# EAGLE design joey (EAGLE 6.2)
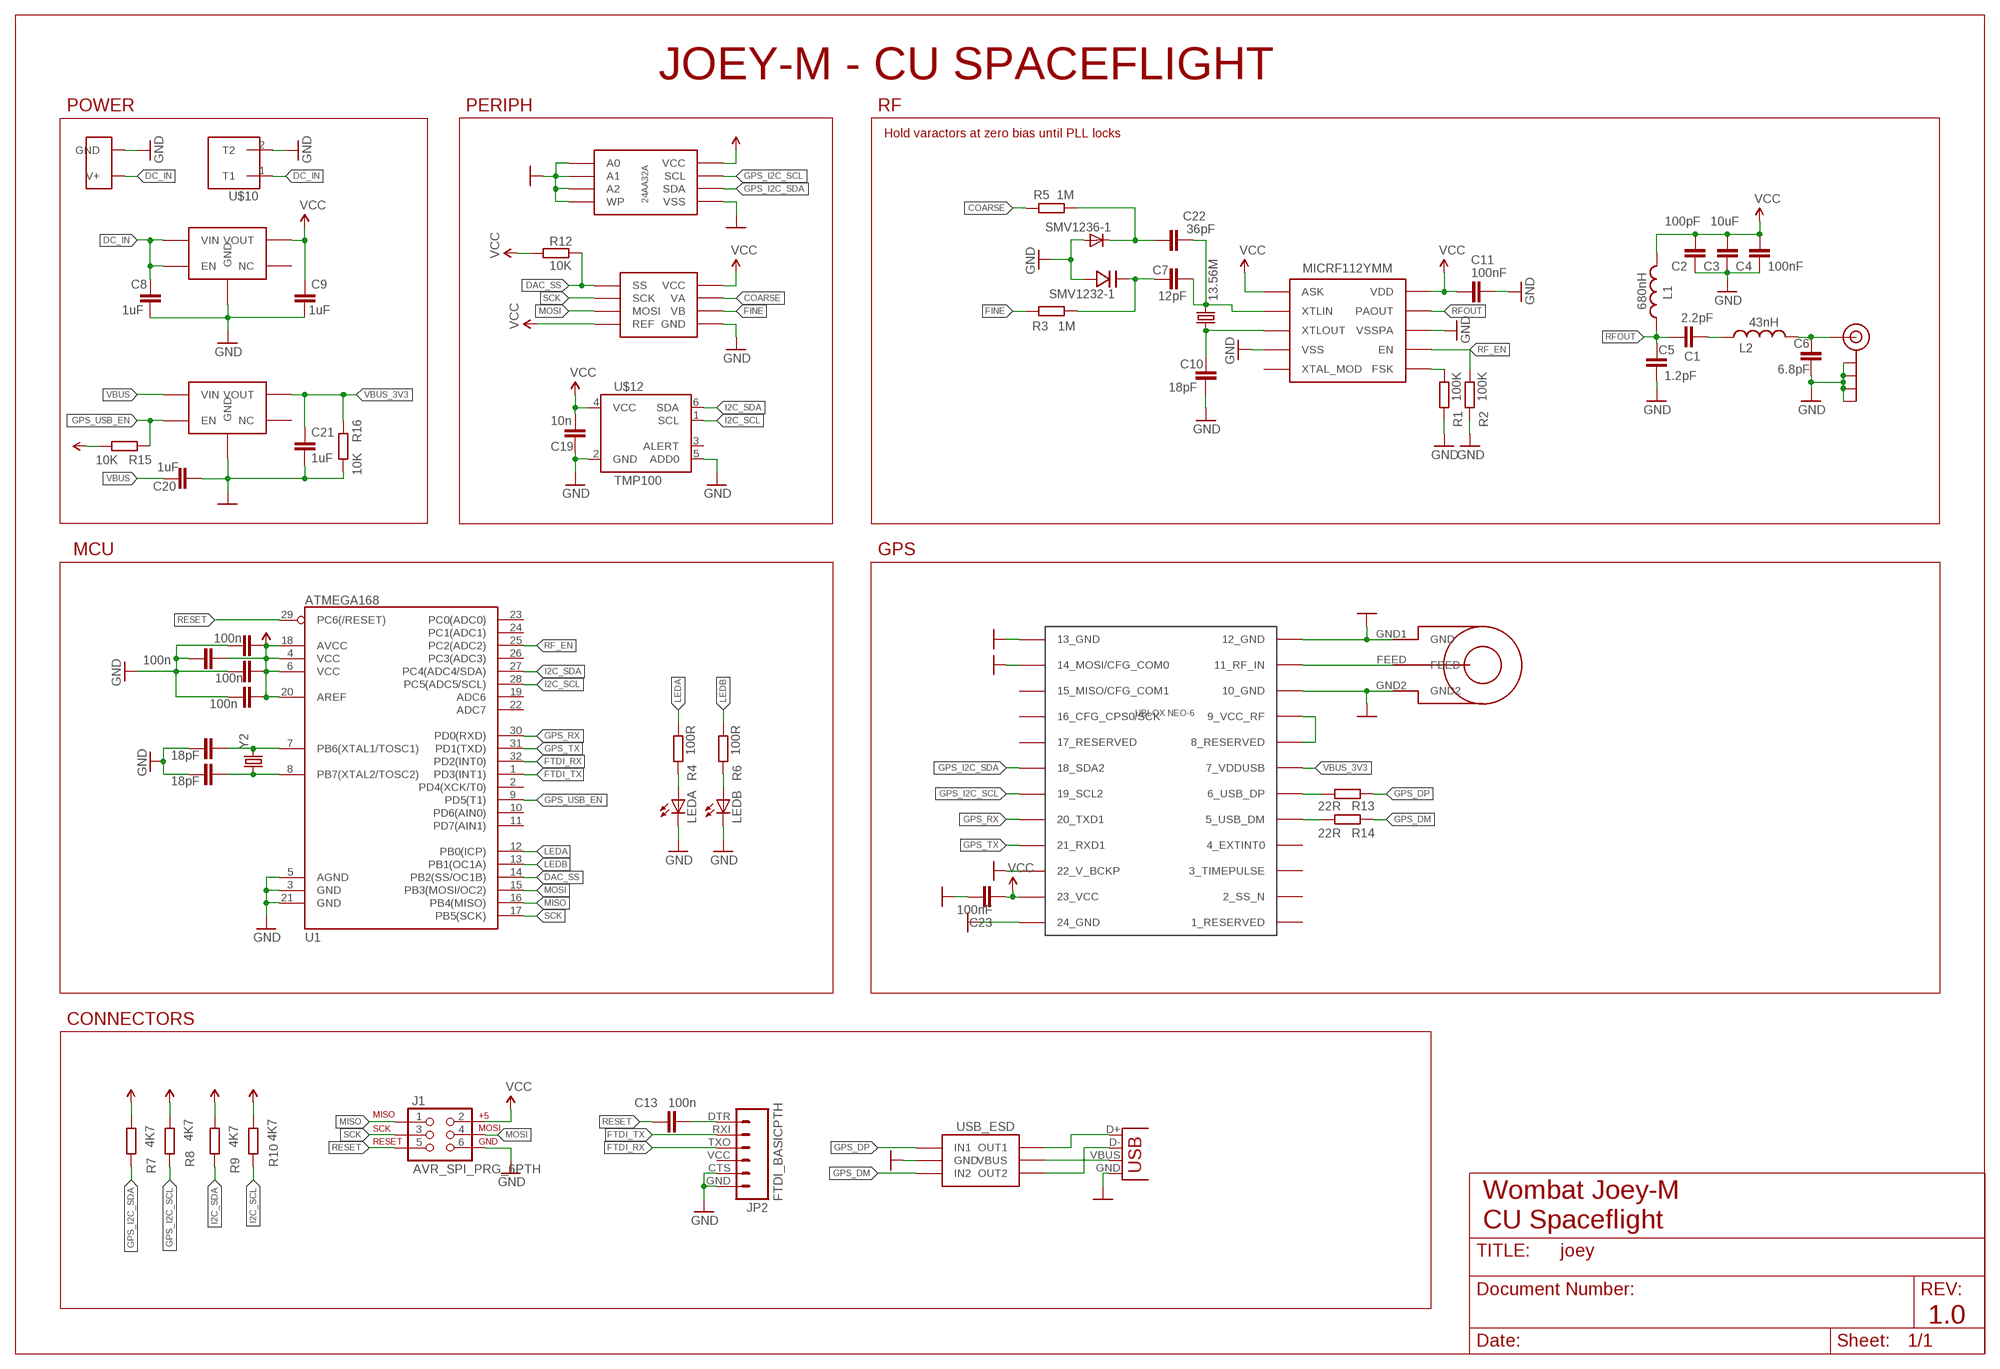
[diagram p0: schematic, sheet 1]

## Parts
C1  2.2pF  C-EUC0603  [C0603]
C2  100pF  C-EUC0603  [C0603]
C3  10uF  C-EUC0603  [C0603]
C4  100nF  C-EUC0603  [C0603]
C5  1.2pF  C-EUC0603  [C0603]
C6  6.8pF  C-EUC0603  [C0603]
C7  12pF  C-EUC0603  [C0603]
C8  1uF  C-EUC0603  [C0603]
C9  1uF  C-EUC0603  [C0603]
C10  18pF  C-EUC0603  [C0603]
C11  100nF  C-EUC0603  [C0603]
C12  100n  C-EUC0603  [C0603]
C13  100n  C-EUC0603  [C0603]
C14  100n  C-EUC0603  [C0603]
C15  100n  C-EUC0603  [C0603]
C16  100n  C-EUC0603  [C0603]
C17  18pF  C-EUC0603  [C0603]
C18  18pF  C-EUC0603  [C0603]
C19  10n  C-EUC0603  [C0603]
C20  1uF  C-EUC0603  [C0603]
C21  1uF  C-EUC0603  [C0603]
C22  36pF  C-EUC0603  [C0603]
C23  100nF  C-EUC0603  [C0603]
J1  AVR_SPI_PRG_6PTH  [2X3]
JP2  FTDI_BASICPTH  [FTDI_BASIC]
L1  680nH  INDUCTOR0603  [0603]
L2  43nH  INDUCTOR0402  [C0402]
LEDA  LED0603  [LED-0603]
LEDB  LED0603  [LED-0603]
R1  100K  R-EU_R0603  [R0603]
R2  100K  R-EU_R0603  [R0603]
R3  1M  R-EU_R0603  [R0603]
R4  100R  R-EU_R0603  [R0603]
R5  1M  R-EU_R0603  [R0603]
R6  100R  R-EU_R0603  [R0603]
R7  4K7  R-EU_R0603  [R0603]
R8  4K7  R-EU_R0603  [R0603]
R9  4K7  R-EU_R0603  [R0603]
R10  4K7  R-EU_R0603  [R0603]
R12  10K  R-EU_R0603  [R0603]
R13  22R  R-EU_R0603  [R0603]
R14  22R  R-EU_R0603  [R0603]
R15  10K  R-EU_R0603  [R0603]
R16  10K  R-EU_R0603  [R0603]
SMV1232-1  SMV1247-VARACTOR  [SMV1247-VARACTOR-SC-79]
SMV1236-1  DIODESOD  [SOD-323]
U1  ATMEGA168  [TQFP32-08]
U$1  MICRF112  [MICRF112-MSOP10]
U$2  SARANTEL-SR1202  [SARANTEL-SR1202]
U$3  UBLOX_NEO-6  [UBLOX_NEO-6P]
U$4  ADP122AUJZ-3V3REG-5TSOT  [SOT23-5L]
U$5  JST_SMTSIDE  [JST_CONN_SMD]
U$6  I2C_EEPROM_24AA32A  [MSOP8]
U$7  SMA_END_19-70-TGG  [SMA_END_19-70-TGG]
U$8  LTC2602_16BIT_DUALDAC  [MSOP8]
U$9  ADP122AUJZ-3V3REG-5TSOT  [SOT23-5L]
U$10  TE_CONN_TERMBLK  [10A_TECONN_TERMBLK]
U$12  TMP100  [SOT23-6]
USB_ESD  USB_ESD_PROT_USBLC6  [SOT23-6]
X1  USB-MICROB  [USB-MICROB]
Y1  13.56M  CRYSTAL5X3  [CRYSTAL-SMD-5X3]
Y2  CRYSTAL5X3  [CRYSTAL-SMD-5X3]

## Nets
COARSE: R5.1 U$8.8(VA)
COARSE_V: C22.1 R5.2 SMV1236-1.1(C)
DAC_SS: R12.2 U1.14(PB2(SS/OC1B)) U$8.1(SS)
DC_IN: C8.2 U$4.1(VIN) U$4.3(EN) U$5.VBATT(V+) U$10.1(T1)
FINE: R3.2 U$8.5(VB)
FTDI_RX: JP2.TXO U1.32(PD2(INT0))
FTDI_TX: JP2.RXI U1.1(PD3(INT1))
GND: C2.1 C3.1 C4.1 C5.1 C6.1 C8.1 C9.1 C10.1 C11.1 C12.2 C14.1 C15.1 C16.1 C17.2 C18.2 C19.1 C20.1 C21.1 C23.1 J1.6 JP2.CTS JP2.GND LEDA.C LEDB.C R1.1 R2.1 R16.2 SMV1232-1.AN(ANODE) SMV1236-1.2(A) U1.3(GND) U1.5(AGND) U1.21(GND) U$1.VSS U$1.VSSPA U$2.GND1(GND) U$2.GND2 U$3.10_GND U$3.12_GND U$3.13_GND U$3.14_MOSI/CFG_COM0 U$3.22_V_BCKP U$3.24_GND U$4.2(GND) U$5.GND U$6.1(A0) U$6.2(A1) U$6.3(A2) U$6.4(VSS) U$6.7(WP) U$7.GND1(GND) U$7.GND2(GND) U$7.GND3(GND) U$7.GND4(GND) U$8.7(GND) U$9.2(GND) U$10.2(T2) U$12.2(GND) U$12.5(ADD0) USB_ESD.2(GND) X1.GND
GPS_DM: R14.1 USB_ESD.3(IN2)
GPS_DP: R13.1 USB_ESD.1(IN1)
GPS_I2C_SCL: R8.1 U$3.19_SCL2 U$6.6(SCL)
GPS_I2C_SDA: R7.1 U$3.18_SDA2 U$6.5(SDA)
GPS_RX: U1.30(PD0(RXD)) U$3.20_TXD1
GPS_TX: U1.31(PD1(TXD)) U$3.21_RXD1
GPS_USB_EN: R15.1 U1.9(PD5(T1)) U$9.3(EN)
I2C_SCL: R10.1 U1.28(PC5(ADC5/SCL)) U$12.1(SCL)
I2C_SDA: R9.1 U1.27(PC4(ADC4/SDA)) U$12.6(SDA)
LEDA: R4.2 U1.12(PB0(ICP))
LEDB: R6.2 U1.13(PB1(OC1A))
MISO: J1.1 U1.16(PB4(MISO))
MOSI: J1.4 U1.15(PB3(MOSI/OC2)) U$8.3(MOSI)
N$1: R1.2 U$1.FSK
N$2: C10.2 U$1.XTLOUT Y1.1
N$3: C13.2 JP2.DTR
N$5: C7.2 C22.2 U$1.XTLIN Y1.3
N$6: C1.2 L2.1
N$7: C6.2 L2.2 U$7.RF(SIGNAL)
N$8: C7.1 R3.1 SMV1232-1.CAT(CATHODE)
N$9: LEDA.A R4.1
N$11: C17.1 U1.7(PB6(XTAL1/TOSC1)) Y2.3
N$12: C18.1 U1.8(PB7(XTAL2/TOSC2)) Y2.1
N$13: U$2.FEED U$3.11_RF_IN
N$14: LEDB.A R6.1
N$15: U$3.8_RESERVED U$3.9_VCC_RF
N$18: USB_ESD.4(OUT2) X1.D-
N$19: USB_ESD.6(OUT1) X1.D+
N$20: R13.2 U$3.6_USB_DP
N$21: R14.2 U$3.5_USB_DM
RESET: C13.1 J1.5 U1.29(PC6(/RESET))
RF_EN: R2.2 U1.25(PC2(ADC2)) U$1.EN
RFOUT: C1.1 C5.2 L1.1 U$1.PAOUT
SCK: J1.3 U1.17(PB5(SCK)) U$8.2(SCK)
VBUS: C20.2 U$9.1(VIN) USB_ESD.5(VBUS) X1.VBUS
VBUS_3V3: C21.2 R16.1 U$3.7_VDDUSB U$9.5(VOUT)
VCC: C2.2 C3.2 C4.2 C9.2 C11.2 C12.1 C14.2 C15.2 C16.2 C19.2 C23.2 J1.2 L1.2 R7.2 R8.2 R9.2 R10.2 R12.1 R15.2 U1.4(VCC) U1.6(VCC) U1.18(AVCC) U1.20(AREF) U$1.ASK U$1.VDD U$3.23_VCC U$4.5(VOUT) U$6.8(VCC) U$8.4(REF) U$8.6(VCC) U$12.4(VCC)
Unconnected: JP2.VCC U1.2(PD4(XCK/T0)) U1.10(PD6(AIN0)) U1.11(PD7(AIN1)) U1.19(ADC6) U1.22(ADC7) U1.23(PC0(ADC0)) U1.24(PC1(ADC1)) U1.26(PC3(ADC3)) U$1.XTAL_MOD U$3.1_RESERVED U$3.2_SS_N U$3.3_TIMEPULSE U$3.4_EXTINT0 U$3.15_MISO/CFG_COM1 U$3.16_CFG_CPS0/SCK U$3.17_RESERVED U$4.4(NC) U$9.4(NC) U$12.3(ALERT)

## Notes on the sheet
- JOEY-M - CU SPACEFLIGHT
- POWER | PERIPH | RF
- Hold varactors at zero bias until PLL locks
- MCU | GPS
- CONNECTORS
- Wombat Joey-M
- CU Spaceflight
- 1.0

## Library data of the parts
C1-C23 = rcl:C-EU: CAPACITOR, European symbol
J1 = SparkFun:AVR_SPI_PRG_6: AVR ISP 6 Pin This is the reduced ISP connector for AVR programming. Common on Arduino. This footprint will take up less PCB space and can be used with a 10-pin to 6-pin adapter such as SKU: BOB-08508
JP2 = SparkFun:FTDI_BASIC: FTDI Basic: 3.3V and 5V
L1 L2 = SparkFun:INDUCTOR: Inductors Basic Inductor/Choke - 0603 and 1206. Footprints are not proven and vary greatly between part numbers.
LEDA LEDB = SparkFun:LED: LEDs Standard schematic elements and footprints for 5mm, 3mm, 1206, and 0603 sized LEDs. 5mm - Spark Fun Electronics SKU : COM-00529 (and others)
R1-R10 R12-R16 = rcl:R-EU_: RESISTOR, European symbol
SMV1232-1 = jonsowman:SMV1247-VARACTOR
SMV1236-1 = SparkFun:DIODE: Diode These are standard reverse protection diodes and small signal diodes. SMA package can handle up to about 1A. SOD-323 can handle about 200mA. What the SOD-323 package when ordering, there are some mfgs out there that are 5-pin packages.
U1 = SparkFun:ATMEGA168
U$1 = jonsowman:MICRF112
U$2 = ava:SARANTEL-SR1202: SARANTEL-SL1202 Author Anthony Stirk / http://ava.upuaut.net Data Sheet : http://docs-europe.electrocomponents.com/webdocs/0dbd/0900766b80dbde80.pdf
U$3 = ava:UBLOX_NEO-6: UBLOX NEO-6 GPS MODULE Author Anthony Stirk / http://ava.upuaut.net http://www.u-blox.com/images/downloads/Product_Docs/LEA-6_NEO-6_MAX-6_HardwareIntegrationManual_%28GPS.G6-HW-09007%29.pdf http://www.u-blox.com/images/downloads/Product_Docs/NEO-6_DataSheet_%28GPS.G6-HW-09005%29.pdf
U$4 U$9 = jonsowman:ADP122AUJZ-3V3REG-5TSOT
U$5 = jonsowman:JST_SMTSIDE
U$6 = jonsowman:I2C_EEPROM_24AA32A
U$7 = jonsowman:SMA_END_19-70-TGG
U$8 = jonsowman:LTC2602_16BIT_DUALDAC
U$10 = jonsowman:TE_CONN_TERMBLK
U$12 = jonsowman:TMP100
USB_ESD = jonsowman:USB_ESD_PROT_USBLC6
X1 = SparkFun:USB: USB Connectors USB-B-PTH is fully proven SKU : PRT-00139 USB-miniB is fully proven SKU : PRT-00587 USB-A-PCB is untested. USB-A-H is throughly reviewed, but untested. Spark Fun Electronics SKU : PRT-00437 USB-B-SMT is throughly reviewed, but untested. Needs silkscreen touching up. USB-A-S has not been used/tested USB-MB-H has not been used/tested
Y1 Y2 = SparkFun:CRYSTAL: Crystals Various standard crystals. Proven footprints. Spark Fun Electronics SKU : COM-00534

## Board
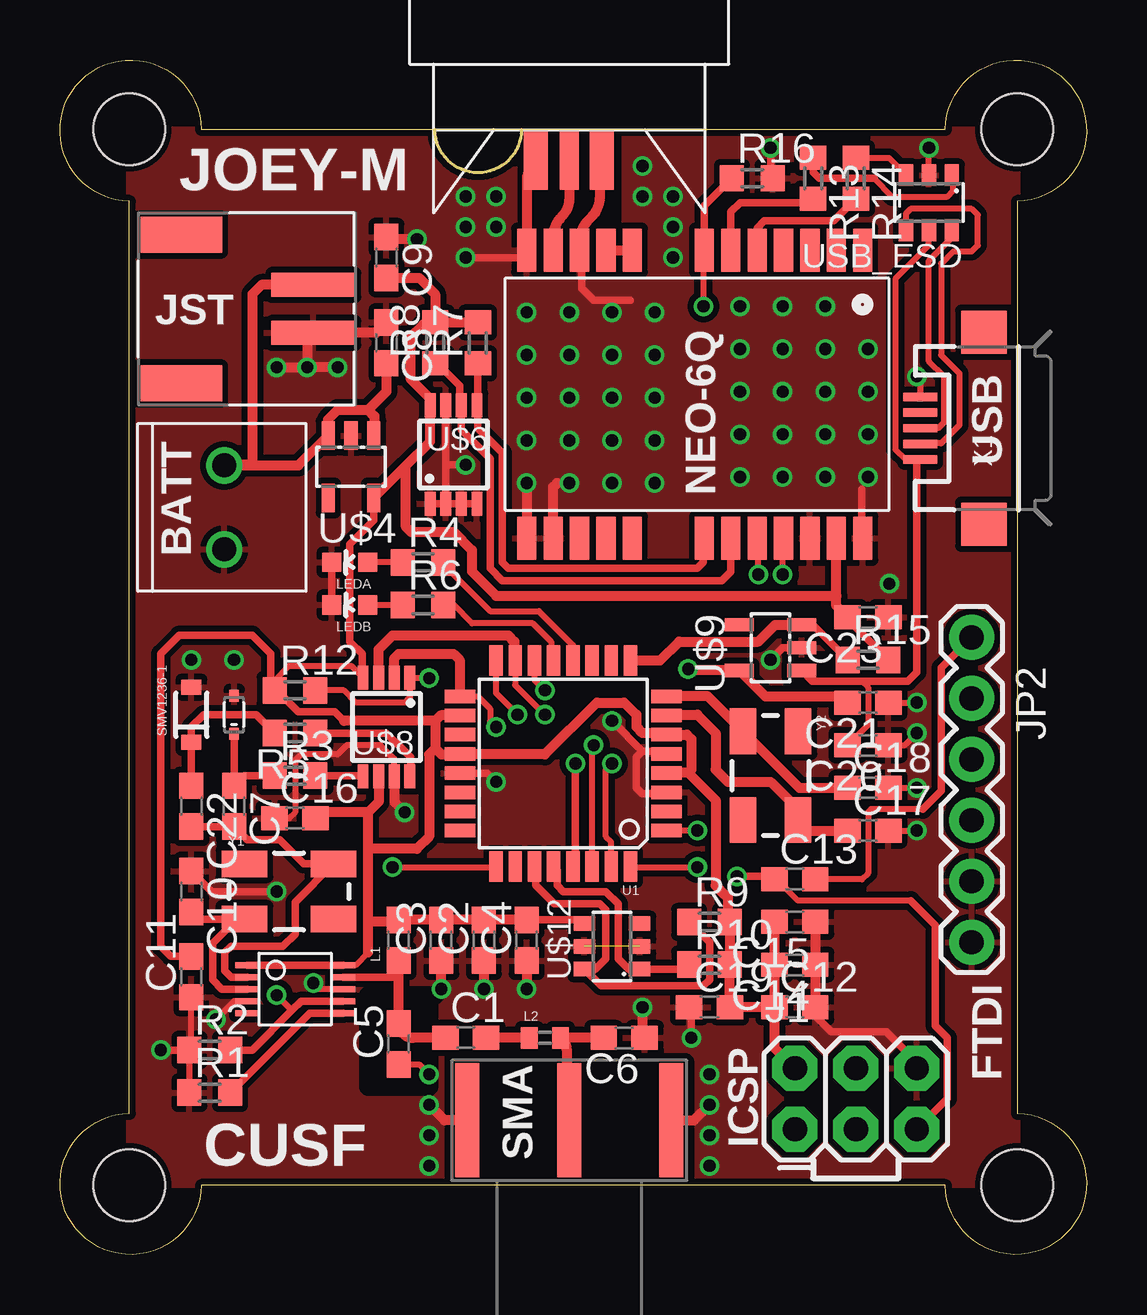
[diagram p1: board, top side]
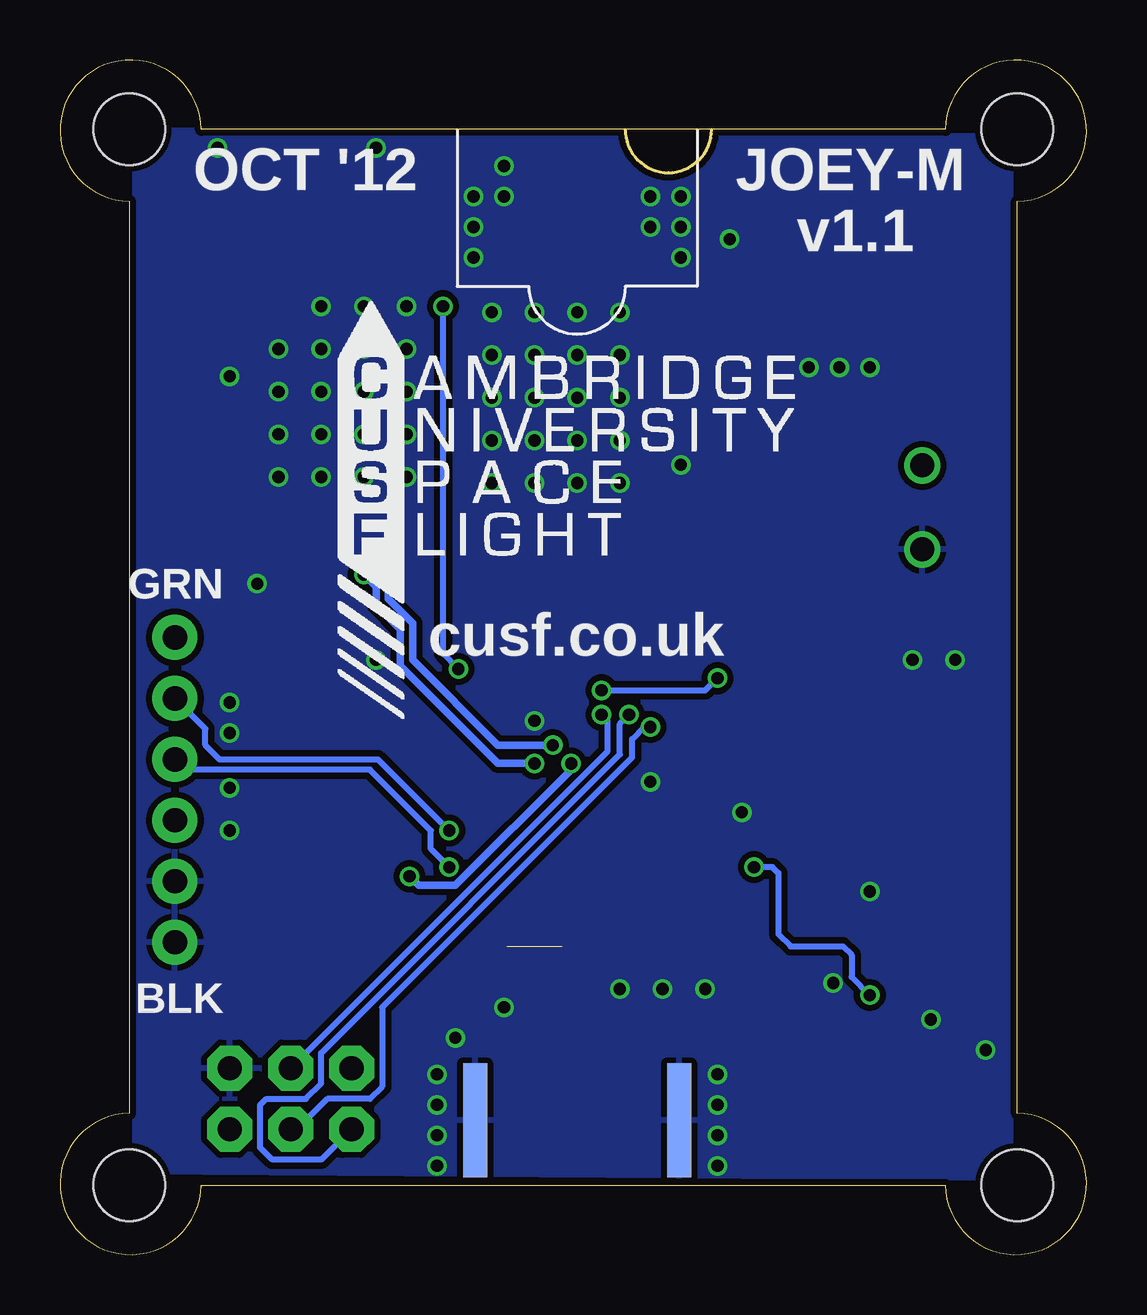
[diagram p2: board, bottom side, seen from below]

Size 42.77 x 49.77 mm. Coordinates in mm from the lower left corner, seen from the top.
Outline: 36.89,46.89 arc-268 39.89,43.89 39.89,5.89 arc-268 36.89,2.89 5.89,2.89 arc-268 2.89,5.89 2.89,43.89 arc-268 5.89,46.89 36.89,46.89
Copper layers (1*16): Top 0.035mm / dielectric 1.5mm / Bottom 0.035mm
Design rules: minimum track width 10mil, minimum drill 12mil, track to track 6mil, track to pad 6mil, pad to pad 6mil, via to via 6mil, smd to smd 0mil, copper to edge 10mil, drill to drill 10mil, minimum pad ring 10mil, minimum via ring 6mil, stop-mask expansion 2mil, vias tented up to drill 100mil, thermal gap 10mil
Holes 3 mm at 39.89,46.89 39.89,2.89 2.89,2.89 2.89,46.89
tRestrict: area 12.8,7 to 15.6,10.8; area 19.4,42.1 to 23,46.6; area 16.4,3.2 to 26,8

### Footprints (pad centres in the part's own frame; a part is rotated, then mirrored left to right if it is on the bottom)
C0603 = smd 1.1 x 1: 1 -0.85,0; 2 0.85,0
2X3 = drill 1.016 pad 1.88 octagon: 1 0,0; 2 0,2.54; 3 2.54,0; 4 2.54,2.54; 5 5.08,0; 6 5.08,2.54
FTDI_BASIC = drill 1.016 pad 1.88: CTS 10.16,0; DTR 0,0; GND 12.7,0; RXI 2.54,0; TXO 5.08,0; VCC 7.62,0
0603 = smd 1.1 x 1: 1 -0.85,0; 2 0.85,0
C0402 = smd 0.7 x 0.9: 1 -0.65,0; 2 0.65,0
LED-0603 = smd 0.8 x 0.8: A 0,-0.75; C 0,0.75
R0603 = smd 1 x 1.1: 1 -0.85,0; 2 0.85,0
SMV1247-VARACTOR-SC-79 = smd 0.5 x 0.4: AN 0.8,0; CAT -0.8,0
SOD-323 = smd 0.63 x 0.83: 1 -1.15,0; 2 1.15,0
TQFP32-08 = smd 1.27 x 0.559: 1 -4.293,2.8; 2 -4.293,2; 3 -4.293,1.2; 4 -4.293,0.4; 5 -4.293,-0.4; 6 -4.293,-1.2; 7 -4.293,-2; 8 -4.293,-2.8; 17 4.293,-2.8; 18 4.293,-2; 19 4.293,-1.2; 20 4.293,-0.4; 21 4.293,0.4; 22 4.293,1.2; 23 4.293,2; 24 4.293,2.8 | smd 0.559 x 1.27: 9 -2.8,-4.293; 10 -2,-4.293; 11 -1.2,-4.293; 12 -0.4,-4.293; 13 0.4,-4.293; 14 1.2,-4.293; 15 2,-4.293; 16 2.8,-4.293; 25 2.8,4.293; 26 2,4.293; 27 1.2,4.293; 28 0.4,4.293; 29 -0.4,4.293; 30 -1.2,4.293; 31 -2,4.293; 32 -2.8,4.293
MICRF112-MSOP10 = smd 0.25 x 1: ASK -1,-2; EN 0.5,2; FSK 1,2; PAOUT -0.5,2; VDD -1,2; VSS 0.5,-2; VSSPA 0,2; XTAL_MOD 1,-2; XTLIN -0.5,-2; XTLOUT 0,-2
SARANTEL-SR1202 = smd 2.5 x 0.8: FEED 0,0 | smd 2.5 x 1: GND1 0,1.4; GND2 0,-1.35
UBLOX_NEO-6P = smd 1.8 x 0.8: 1_RESERVED 6.4,-7.4; 2_SS_N 6.4,-6.3; 3_TIMEPULSE 6.4,-5.2; 4_EXTINT0 6.4,-4.1; 5_USB_DM 6.4,-3; 6_USB_DP 6.4,-1.9; 7_VDDUSB 6.4,-0.8; 8_RESERVED 6.4,2.2; 9_VCC_RF 6.4,3.3; 10_GND 6.4,4.4; 11_RF_IN 6.4,5.5; 12_GND 6.4,6.6; 13_GND -5.6,6.6; 14_MOSI/CFG_COM0 -5.6,5.5; 15_MISO/CFG_COM1 -5.6,4.4; 16_CFG_CPS0/SCK -5.6,3.3; 17_RESERVED -5.6,2.2; 18_SDA2 -5.6,-0.8; 19_SCL2 -5.6,-1.9; 20_TXD1 -5.6,-3; 21_RXD1 -5.6,-4.1; 22_V_BCKP -5.6,-5.2; 23_VCC -5.6,-6.3; 24_GND -5.6,-7.4
SOT23-5L = smd 0.55 x 1.2: 1 -0.95,-1.3; 2 0,-1.3; 3 0.95,-1.3; 4 0.95,1.3; 5 -0.95,1.3
JST_CONN_SMD = smd 1 x 3.5: GND -1,-2.8; VBATT 1,-2.8 | smd 1.5 x 3.4: NC1 -3.1,2.7; NC2 3.1,2.7
MSOP8 = smd 0.45 x 1: 1 -0.975,-2.05; 2 -0.325,-2.05; 3 0.325,-2.05; 4 0.975,-2.05; 5 0.975,2.05; 6 0.325,2.05; 7 -0.325,2.05; 8 -0.975,2.05
SMA_END_19-70-TGG = smd 1 x 4.75: GND1 -4.25,-2.4; GND2 4.25,-2.4; RF 0,-2.4 | smd 1 x 4.75 bottom: GND3 -4.25,-2.4; GND4 4.25,-2.4
10A_TECONN_TERMBLK = drill 1: 1 -1.75,0.1; 2 1.75,0.1
SOT23-6 = smd 0.6 x 0.9: 1 -0.95,-1.15; 2 0,-1.15; 3 0.95,-1.15; 4 0.95,1.15; 5 0,1.15; 6 -0.95,1.15
USB-MICROB = smd 0.35 x 1.4: D+ 0,2.65; D- -0.65,2.65; GND 1.3,2.65; ID 0.65,2.65; VBUS -1.3,2.65 | smd 1.8 x 1.9: MT1 -4,0; MT2 4,0
CRYSTAL-SMD-5X3 = smd 1.9 x 1.1: 1 -1.85,-1.15; 2 1.85,-1.15; 3 1.85,1.15; 4 -1.85,1.15

### Placement (x,y rotation side)
C1  16.9,9.03 0 top
C2  17.67,13.09 90 top
C3  15.89,13.09 90 top
C4  19.44,13.09 90 top
C5  14.11,8.78 90 top
C6  23.51,9.03 180 top
C7  7.25,18.68 270 top
C8  13.6,37.99 270 top
C9  13.6,41.54 270 top
C10  5.47,15.13 270 top
C11  5.47,11.57 90 top
C12  30.62,10.3 0 top
C13  30.62,15.63 0 top
C14  30.62,12.08 180 top
C15  30.62,13.86 180 top
C16  9.79,18.17 0 top
C17  33.67,17.67 0 top
C18  33.67,19.44 0 top
C19  27.06,10.3 0 top
C20  33.67,21.22 180 top
C21  33.67,23 180 top
C22  5.47,18.68 270 top
C23  33.67,26.56 180 top
J1  30.62,5.22 0 top
JP2  37.99,25.71 270 top
L1  14.11,13.09 90 top
L2  20.21,9.03 0 top
LEDA  12.08,28.84 90 top
LEDB  12.08,27.06 90 top
R1  6.24,6.74 0 top
R2  6.24,8.52 0 top
R3  9.79,19.95 0 top
R4  15.13,28.84 0 top
R5  9.79,21.73 180 top
R6  15.13,27.06 0 top
R7  17.41,37.99 90 top
R8  15.63,37.99 90 top
R9  27.06,13.86 0 top
R10  27.06,12.08 0 top
R12  9.79,23.51 0 top
R13  31.38,44.84 270 top
R14  33.16,44.84 270 top
R15  33.67,24.78 0 top
R16  28.84,44.84 0 top
SMV1232-1  7.25,22.49 90 top
SMV1236-1  5.47,22.49 90 top
U1  20.97,20.46 180 top
U$1  9.79,11.06 270 top
U$2  21.22,45.61 90 top
U$3  26.05,35.45 90 top
U$4  12.13,32.83 180 top
U$5  7.76,39.4 90 top
U$6  16.4,33.33 0 top
U$7  21.22,3.19 180 top
U$8  13.6,21.98 180 top
U$9  29.6,25.29 90 top
U$10  6.74,31.13 270 top
U$11  [CUSF_LOGO_LARGE]  31.38,22.24 0 bottom
U$12  23,12.84 90 top
USB_ESD  36.21,43.83 180 top
X1  38.49,34.43 90 top
Y1  9.54,15.13 0 top
Y2  29.6,19.95 270 top

### Tracks (layer width: path | path; a pad name or v marks a point on that pad's centre or on a via)
COARSE
  Top 0.305: U$8.8 14.62,19.98 14.62,20.71 13.6,21.73 R5.1
COARSE_V
  Top 0.305: C22.1 SMV1236-1.1 5.47,21.98 5.98,22.49 8.18,22.49 R5.2
DAC_SS  (via drill 0.51)
  Top 0.254: U$8.1 14.58,23.21 14.36,23 12.33,23 11.82,23.51 R12.2 | v15.38,24.02 14.6,24.02 | U1.14 19.77,23.95 v20.21,23.51
  Top 0.406: 14.6,24.02 U$8.1 | 10.55,23.51 R12.2
  Bottom 0.254: v20.21,23.51 15.89,23.51 v15.38,24.02
DC_IN
  Top 0.406: 12.84,35.19 11.57,35.19 11.18,34.8 U$4.3 9.93,32.88 U$10.1 6.87,32.91 8.01,32.91 8.01,40.02 8.4,40.4 U$5.VBATT | 12.84,35.19 13.09,34.94 13.09,34.14 U$4.1 | C8.2 13.6,35.95 12.84,35.19
FINE
  Top 0.305: R3.2 12.61,19.95 U$8.5
FTDI_RX  (via drill 0.51)
  Top 0.254: U1.32 23.79,16.14 v26.56,16.14
  Bottom 0.254: v26.56,16.14 27.32,16.9 27.32,17.67 29.86,20.21 37.56,20.21 JP2.TXO
FTDI_TX  (via drill 0.51)
  Top 0.254: v26.56,17.67 25.27,17.67 U1.1
  Bottom 0.254: v26.56,17.67 29.52,20.63 36.13,20.63 36.72,21.22 36.72,21.9 JP2.RXI
GND  (via drill 0.51)  (1 unrouted)
  Top 0.254: R1.1 R2.1 5.47,8.61 C11.1 5.63,10.56 | U$8.7 13.93,20.64 13.35,21.22 11.95,21.22 11.57,20.84 10.05,20.84 9.79,20.59 9.79,18.43 9.54,18.17 C16.1 | C21.1 v35.7,23 | USB_ESD.2 v36.21,46.11 | C5.1 14.96,7.93 v15.38,7.51 | U$1.VSSPA 10.81,11.06 v10.55,11.32 | U$1.VSS 7.77,10.56 7.76,10.55 7.25,10.55 v6.49,9.79 | C18.2 v35.7,19.44 | C17.2 v35.7,17.67 | C20.1 35.19,21.22 v35.7,21.73 | v35.7,36.59 35.84,36.45 X1.GND
  Top 0.305: U$6.4 U$6.3 U$6.2 | U$6.2 U$6.1 | U$6.7 16.07,32.91 | 16.07,32.91 U$6.2 | LEDA.C LEDB.C | U$4.2 12.08,34.08 | U$3.12_GND 19.45,41.8 19.44,41.8 19.44,41.54 v16.9,41.54 | U1.3 25.19,19.19 24.27,19.19 24.02,19.44 24.02,20.71 24.27,20.97 | 33.41,31.89 33.41,29.85 U$3.24_GND | U$3.22_V_BCKP 31.13,29.97 | 34.52,23.21 C21.1 34.43,23 | R2.1 v4.2,8.52 | C19.1 26.3,10.21 v26.3,9.03 | v16.9,32.91 16.07,32.91 | v9.03,15.13 6.32,15.13 C10.1 | U1.21 17.81,20.06 v18.17,19.7 | C15.1 31.47,9.96 32.14,9.28 34.43,9.28 35.7,8.01 J1.6 | 23.76,39.76 22.24,39.76 21.73,40.27 21.73,41.8 21.7,41.8 U$3.10_GND | 24.27,20.97 25.29,20.97 25.29,20.89 U1.5 | 24.27,20.97 v23,22.24 | R16.2 29.6,44.93 v29.6,46.11 | U$9.2 30.11,25.29 v29.6,24.78
  Top 0.406: C2.1 v17.67,11.06 | C4.1 v19.44,11.06 | U$3.10_GND 21.65,42.2 arc-45 22.02,43.1 22.12,43.2 arc45 22.49,44.1 22.49,45.53 U$2.GND2 | U$7.GND4 16.03,5.59 v15.38,6.24 | U$7.GND3 26.42,5.59 v27.06,6.24 | C15.1 C14.1 C12.2 | U$2.GND1 U$2.GND1 arc45 19.45,44.71 U$3.12_GND | v24.27,10.3 24.27,9.12 C6.1 | v15.89,11.06 C3.1 | U$8.7 13.93,18.87 v14.36,18.43 | v11.57,36.97 v10.3,36.97 | v10.3,36.97 10.3,38.14 U$5.GND 13.17,38.4 C8.1 | v9.03,36.97 v10.3,36.97 | v19.44,32.14 U$3.13_GND | U$3.14_MOSI/CFG_COM0 20.55,31.98 20.71,32.14 | v14.87,42.3 13.69,42.3 C9.1
  other vias: 15.38,4.97 15.38,3.7 27.06,7.51 27.06,4.97 27.06,3.7 19.44,37.48 19.44,39.26 19.44,33.92 25.54,41.54 25.54,42.81 24.27,44.08 18.17,44.08 16.9,44.08 16.9,42.81 18.17,42.81 34.56,27.95 19.44,35.7 21.22,32.14 21.22,33.92 21.22,35.7 21.22,37.48 21.22,39.26 23,32.14 23,33.92 23,35.7 23,37.48 23,39.26 24.78,32.14 24.78,33.92 24.78,35.7 24.78,37.48 24.78,39.26 28.33,32.4 28.33,34.18 28.33,35.95 28.33,37.73 28.33,39.51 30.11,32.4 30.11,34.18 30.11,35.95 30.11,37.73 30.11,39.51 31.89,32.4 31.89,34.18 31.89,35.95 31.89,37.73 31.89,39.51 33.67,32.4 33.67,34.18 33.67,35.95 33.67,37.73 25.54,44.08 24.27,45.35 5.47,24.78 7.25,24.78
  pour Bottom (isolate 0.254): 3.19,3.19 39.64,3.44 39.64,46.88 3.19,46.62
  pour Top (isolate 0.254): 2.89,46.89 39.89,46.89 39.89,2.89 2.89,2.89
GPS_DM
  Top 0.254: R14.1 34.54,45.69 USB_ESD.3
GPS_DP
  Top 0.254: 33.92,44.84 34.68,44.08 36.97,44.08 37.22,44.34 37.22,44.91 USB_ESD.1
  Top 0.305: 33.92,44.84 31.64,44.84 31.38,45.1 R13.1
GPS_I2C_SCL
  Top 0.305: R8.1 15.72,37.14 16.65,36.21 16.65,35.46 U$6.6 16.72,34.36 17.92,33.16 17.92,28.59 18.43,28.08 27.57,28.08 27.95,28.46 U$3.19_SCL2
GPS_I2C_SDA
  Top 0.305: R7.1 17.41,35.43 | 17.41,35.43 U$6.5 | 17.41,35.43 17.41,34.43 18.43,33.41 18.43,28.84 18.68,28.59 26.56,28.59 26.81,28.84 26.81,29.81 U$3.18_SDA2
GPS_RX  (via drill 0.51)
  Top 0.254: U1.30 22.17,21.15 v22.24,21.22 | v29.1,28.33 29.1,29.89 U$3.20_TXD1
  Bottom 0.305: v29.1,28.33 29.1,27.32 28.08,26.3 28.08,24.78 24.52,21.22 v22.24,21.22
GPS_TX  (via drill 0.51)
  Top 0.254: 22.97,20.43 v23,20.46 22.75,20.21 22.75,17.41 22.97,17.19 U1.31 | v30.11,28.33 30.11,29.88 U$3.21_RXD1
  Bottom 0.305: v23,20.46 24.52,20.46 28.59,24.52 28.59,26.05 29.6,27.06 29.6,27.83 v30.11,28.33
GPS_USB_EN
  Top 0.305: R15.1 31.36,26.24 U$9.3
  Top 0.406: U1.9 25.01,24.75 25.79,25.54 29.1,25.54 29.79,26.24 U$9.3
I2C_SCL
  Top 0.305: U1.28 20.71,16.02 20.71,15.38 20.97,15.13 22.75,15.13 23.25,14.62 23.25,12.33 23.7,11.89 U$12.1 26.03,11.89 R10.1
I2C_SDA
  Top 0.305: U1.27 19.83,16.11 19.83,15.38 20.59,14.62 22.49,14.62 22.75,14.36 22.75,12.33 22.3,11.89 U$12.6 22.55,11.19 26.81,11.19 27.06,11.44 27.06,13.01 R9.1
LEDA
  Top 0.254: U1.12 21.37,25.39 19.95,26.81 17.92,26.81 15.98,28.75 R4.2
LEDB
  Top 0.254: R6.2 16.4,27.06 17.16,26.3 19.7,26.3 20.46,25.54 20.46,24.86 U1.13
MISO  (via drill 0.51)
  Top 0.254: v19.06,22.49 18.17,23.39 U1.16
  Bottom 0.254: J1.1 31.89,3.95 33.92,3.95 34.43,4.46 34.43,6.24 34.18,6.49 32.53,6.49 31.89,7.13 31.89,8.4 19.44,20.84 19.44,22.11 v19.06,22.49
MOSI  (via drill 0.51)
  Top 0.254: v20.21,22.49 18.97,23.73 U1.15 18.94,24.72 18.94,24.52
  Top 0.406: U$8.3 13.28,25.22 13.86,25.79 18.68,25.79 18.94,25.54 18.94,24.52
  Bottom 0.254: J1.4 19.95,20.97 19.95,22.24 v20.21,22.49
N$1
  Top 0.305: U$1.FSK 10.4,10.06 R1.2
N$2
  Top 0.305: Y1.1 6.74,13.98 | U$1.XTLOUT 6.74,11.06 6.36,11.44 6.36,12.97 7.37,13.98 Y1.1 | Y1.1 5.77,13.98 C10.2
N$3
  Top 0.254: 35.95,18.56 33.8,18.56 33.67,18.43 33.67,15.89 33.41,15.63 C13.2
  Top 0.305: 35.95,18.56 36.72,19.32 36.72,24.44 JP2.DTR
N$5
  Top 0.305: C22.2 C7.2 7.8,17.29 9.16,17.29 10.17,16.28 Y1.3 9.79,14.68 9.79,13.35 9.28,12.84 7.13,12.84 6.87,12.59 6.87,11.82 7.13,11.56 U$1.XTLIN
N$6
  Top 0.406: L2.1 C1.2
N$7
  Top 0.406: C6.2 L2.2 20.96,8.93 arc-45 21.11,8.57 21.11,5.7 U$7.RF
N$8
  Top 0.305: SMV1232-1.CAT C7.1 7.67,19.95 R3.1
N$9
  Top 0.254: R4.1 LEDA.A
N$11
  Top 0.406: C17.1 31.19,17.67 Y2.3 30.75,18.55 29.6,19.7 27.83,19.7 27.32,20.21 27.32,21.73 26.56,22.49 25.29,22.49 U1.7
N$12
  Top 0.406: U1.8 27,23.26 Y2.1 30.81,19.44 C18.1
N$13
  Top 0.406: U$2.FEED 21.22,44 arc-45 20.92,43.27 arc45 20.55,42.37 U$3.11_RF_IN
N$14
  Top 0.254: LEDB.A R6.1
N$15
  Top 0.406: U$3.9_VCC_RF U$3.8_RESERVED
N$18
  Top 0.254: USB_ESD.4 35.26,43.39 35.45,43.57 37.99,43.57 38.24,43.32 38.24,42.05 37.99,41.8 37.22,41.8 36.72,41.29 36.72,37.48 37.48,36.72 37.48,34.56 36.72,33.8 35.86,33.8 X1.D-
N$19
  Top 0.254: X1.D+ 36.59,34.43 36.84,34.68 36.84,36.59 36.21,37.22 36.21,41.42 37.16,42.37 USB_ESD.6
N$20
  Top 0.305: U$3.6_USB_DP 27.95,43.44 28.33,43.83 31.22,43.83 R13.2
N$21
  Top 0.305: U$3.5_USB_DM 29.05,42.76 29.35,43.07 32.23,43.07 R14.2
RESET  (via drill 0.51)
  Top 0.254: 35.45,14.75 30.75,14.75 29.86,15.63
  Top 0.305: 35.45,14.75 36.46,13.73 36.46,9.54 36.97,9.03 36.97,6.49 J1.5 | U1.29 21.37,16.54 21.48,16.65 v21.48,20.46 | v28.21,15.76 29.64,15.76 C13.1 29.86,15.63
  Bottom 0.305: v21.48,20.46 21.48,20.21 26.3,15.38 27.83,15.38 v28.21,15.76
RF_EN  (via drill 0.51)
  Top 0.254: v13.86,16.14 18.14,16.14 U1.25 | v9.03,10.81 9.67,10.17 | U$1.EN 11.78,10.55
  Top 0.305: R2.2 8.01,8.52 9.67,10.17 10.05,10.55 11.78,10.55
  Bottom 0.254: v13.86,16.14 13.09,16.14 12.84,15.89 12.84,13.35 12.33,12.84 10.15,12.84 9.79,12.48 9.79,11.57 v9.03,10.81
RFOUT
  Top 0.254: 14.11,11.82 L1.1
  Top 0.305: U$1.PAOUT 14.11,11.56
  Top 0.406: C1.1 14.71,9.03 arc-90 C5.2 14.11,11.56 14.11,11.82
SCK  (via drill 0.51)
  Top 0.254: U1.17 17.41,23.26 17.92,22.75 17.92,22.24 v18.17,21.98
  Top 0.406: U$8.2 13.93,24.85 14.11,25.03 16.4,25.03 16.65,24.78 16.65,23.29 U1.17
  Bottom 0.254: v18.17,21.98 18.43,21.98 18.94,21.48 18.94,20.71 29.35,10.3 29.35,7 29.86,6.49 31.64,6.49 32.91,5.22 J1.3
VBUS
  Top 0.254: 33.41,23.89 33.67,23.64 33.67,22.07 C20.2 | USB_ESD.5 36.21,42.05 34.81,40.65 34.81,33.54 35.22,33.13 X1.VBUS
  Top 0.305: U$9.1 31.35,23.89 33.41,23.89 35.32,23.89 35.7,24.27 35.7,32.99 X1.VBUS
VBUS_3V3  (via drill 0.51)
  Top 0.254: C21.2 32.91,23 | U$3.7_VDDUSB 26.81,41.81 v26.81,39.51
  Top 0.305: U$3.7_VDDUSB 26.85,43.7 R16.1
  Top 0.406: C21.2 32.56,23.25 29.39,23.25 U$9.5 26.24,24.34 v26.18,24.4
  Bottom 0.254: v26.18,24.4 26.81,25.03 v26.81,39.51
VCC
  Top 0.254: R12.1 8.94,23.93 9.54,24.52 12.14,24.52 U$8.4 | U$6.8 15.42,35.66 | 15.13,38.75 15.55,38.75 R8.2 | 10.9,18.43 C16.2 | U$1.VDD 12.32,12.06 12.84,12.59 | 26.3,20.21 26.18,20.08 | 25.28,20.08 U1.4 | U1.6 25.19,21.73 | 27.45,15.25 27.7,15
  Top 0.305: U$4.5 13.08,30.6 12.08,29.6 12.08,25.54 12.59,25.03 12.59,24.08 U$8.4 | 27.83,13.94 R9.2 | 11.82,22.24 11.44,22.62 9.92,22.62 9.03,23.51 | C11.2 4.62,12.42 4.2,12.84 4.2,25.03 4.97,25.79 8.01,25.79 8.78,25.03 8.78,23.76 9.03,23.51 | R12.1 9.03,23.51 | U$1.ASK U$1.VDD | C23.2 32.82,26.48 R15.2 | C4.2 21.7,13.94 U$12.4
  Top 0.406: R7.2 R8.2 15.63,40.02 14.96,40.69 C9.2 | U$4.5 14.41,32.86 | 14.41,32.86 15.42,33.87 U$6.8 | R9.2 R10.2 C19.2 C12.1 | C15.2 C14.2 C12.1 | 15.42,35.66 14.62,36.46 14.62,38.24 15.13,38.75 | U1.18 15.86,22.46 15.63,22.24 | 15.63,22.24 15.63,21.1 | 15.63,21.1 15.89,20.84 16.66,20.84 U1.20 16.69,20.84 20.21,20.84 22.37,23 23.51,23 24.02,22.49 24.02,21.98 24.27,21.73 25.19,21.73 | U$8.6 13.28,18.87 12.84,18.43 | 12.84,18.43 10.9,18.43 | 12.84,12.59 12.84,13.86 | 12.84,13.86 12.84,16.9 | 12.84,16.9 12.84,18.43 | U1.6 26.12,21.66 26.3,21.48 26.3,20.21 | 25.28,20.08 26.18,20.08 27.32,18.94 27.32,15.38 27.7,15 27.83,14.87 27.83,13.94 | 15.63,21.1 15.38,20.84 15.38,17.41 14.87,16.9 12.84,16.9 | 15.63,22.24 11.82,22.24 | C12.1 29.77,8.61 J1.2 | C4.2 C2.2 C3.2 L1.2 14.02,13.86 12.84,13.86 | 32.35,27.45 18.17,27.45 17.16,28.46 17.16,29.35 16.4,30.11 14.62,30.11 14.41,30.32 14.41,32.86 | C23.2 32.35,27.03 32.35,27.45 | 32.35,27.45 U$3.23_VCC

### Text on the board
tPlace: JOEY-M | JST | USB | NEO-6Q | BATT | FTDI | ICSP | CUSF | SMA
bPlace: JOEY-M | OCT '12 | v1.1 | GRN | cusf.co.uk | BLK